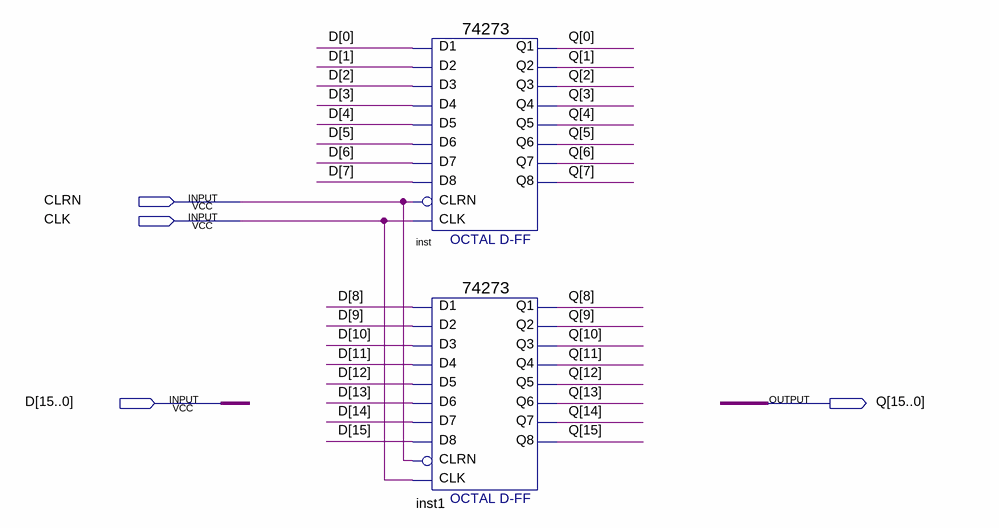
[diagram p0: schematic sheet]
// Quartus schematic X.bdf as structural Verilog: 2 symbols, 4 pins
module X (
  input  CLRN,
  input  CLK,
  input  [15:0] D,
  output [15:0] Q
);

  \74273  inst (
    .D2(D[1]), .D3(D[2]), .D1(D[0]), .D4(D[3]), .D7(D[6]), .D6(D[5]), .D5(D[4]), .D8(D[7]), .CLK(CLK),
    .CLRN(CLRN), .Q4(Q[3]), .Q1(Q[0]), .Q2(Q[1]), .Q3(Q[2]), .Q6(Q[5]), .Q5(Q[4]), .Q7(Q[6]), .Q8(Q[7]));
  \74273  inst1 (
    .D2(D[9]), .D3(D[10]), .D1(D[8]), .D4(D[11]), .D7(D[14]), .D6(D[13]), .D5(D[12]), .D8(D[15]), .CLK(CLK),
    .CLRN(CLRN), .Q4(Q[11]), .Q1(Q[8]), .Q2(Q[9]), .Q3(Q[10]), .Q6(Q[13]), .Q5(Q[12]), .Q7(Q[14]), .Q8(Q[15]));
endmodule
